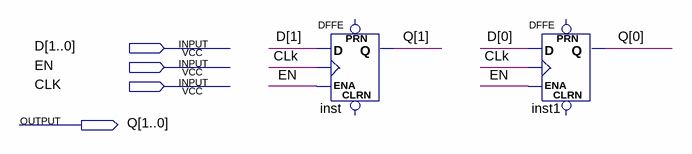
[diagram p0: schematic sheet]
// Quartus schematic DFF_2bit.bdf as structural Verilog: 2 symbols, 4 pins
module DFF_2bit (
  input  [1:0] D,
  input  EN,
  input  CLK,
  output [1:0] Q
);

  DFFE inst (.D(D[1]), .CLK(CLK), .ENA(EN), .Q(Q[1]));  // open: PRN, CLRN
  DFFE inst1 (.D(D[0]), .CLK(CLK), .ENA(EN), .Q(Q[0]));  // open: PRN, CLRN
endmodule
